# Altium schematic sheet ETH10M100_RJ45wLED.SchDoc
size A3
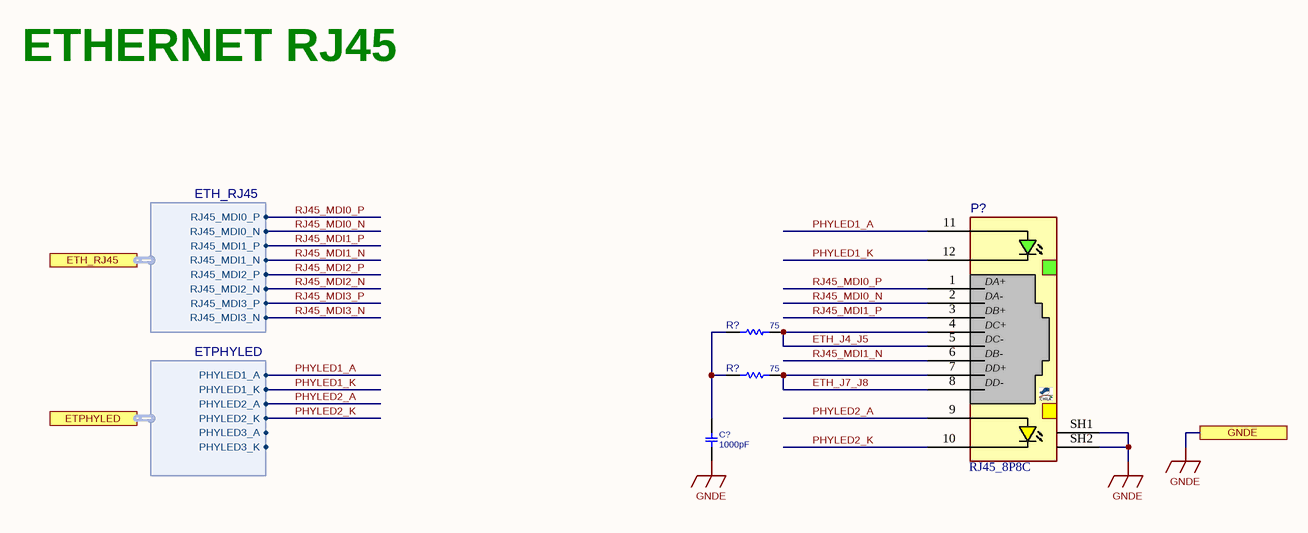
[diagram p0: ETH10M100_RJ45wLED.SchDoc]

## Parts
(Parts that share a designator on the sheet are numbered #1, #2 ... from top to bottom, then left to right.)
C?  1000pF  [C1206]
P?  RJ45_8P8C  [RJ45_8S_RA_TU_L]
R?#1  75  [R0603O]
R?#2  75  [R0603O]

## Ports
ETH_RJ45 (harness ETH_RJ45), ETPHYLED (harness ETPHYLED), GNDE

## Harnesses
ETPHYLED: PHYLED1_A, PHYLED1_K, PHYLED2_A, PHYLED2_K, PHYLED3_A, PHYLED3_K
ETH_RJ45: RJ45_MDI0_P, RJ45_MDI0_N, RJ45_MDI1_P, RJ45_MDI1_N, RJ45_MDI2_P, RJ45_MDI2_N, RJ45_MDI3_P, RJ45_MDI3_N

## Nets
GNDE: C?.2 P?.SH1 P?.SH2 ; port GNDE
ETH_J4_J5: P?.4(DC+) P?.5(DC-) R?#1.2
ETH_J7_J8: P?.7(DD+) P?.8(DD-) R?#2.2
PHYLED1_A: P?.11(GLED+) ; port ETPHYLED.PHYLED1_A
PHYLED1_K: P?.12(GLED-) ; port ETPHYLED.PHYLED1_K
PHYLED2_A: P?.9(YLED+) ; port ETPHYLED.PHYLED2_A
PHYLED2_K: P?.10(YLED-) ; port ETPHYLED.PHYLED2_K
RJ45_MDI0_N: P?.2(DA-) ; port ETH_RJ45.RJ45_MDI0_N
RJ45_MDI0_P: P?.1(DA+) ; port ETH_RJ45.RJ45_MDI0_P
RJ45_MDI1_N: P?.6(DB-) ; port ETH_RJ45.RJ45_MDI1_N
RJ45_MDI1_P: P?.3(DB+) ; port ETH_RJ45.RJ45_MDI1_P
RJ45_MDI2_N: port ETH_RJ45.RJ45_MDI2_N
RJ45_MDI2_P: port ETH_RJ45.RJ45_MDI2_P
RJ45_MDI3_N: port ETH_RJ45.RJ45_MDI3_N
RJ45_MDI3_P: port ETH_RJ45.RJ45_MDI3_P
NetC?_1: C?.1 R?#1.1 R?#2.1

## Notes on the sheet
- ETHERNET RJ45

## Library data of the parts
C? = CAP_SMD_MLCC_22n50V: CAP, MLCC; MANF_P#: 1206B102K202NT; PARAM2: 2kV; MANF: -; PARAM: -; DESC: -; PRICE: $0.006; VALUE: 1000pF
P? = RJ45_8S_RA_TU_L: RJ45, 8P+LED, SHIELDED, RightAngle, TabUP; MANF: WURTH; MANF_P#: 615008137421; PRICE: 1.2$; VALUE: RJ45_8P8C
R?#1 R?#2 = RES_SMD_1K_0402YK: RESISTOR, SMD, THICK FILM, YAGEO; MANF_P#: RC0402FR-071KL; PARAM: 0.063W; DESC: DESCRIPTION; DIST#: MOUSER; PARAM2: 1%; MANF: Yageo; ASSEMBLY: ASSEMBLY; PRICE: 100= 0.3$; VALUE: 75